# EAGLE design TurntableStrobeModule (EAGLE 7.1.0)
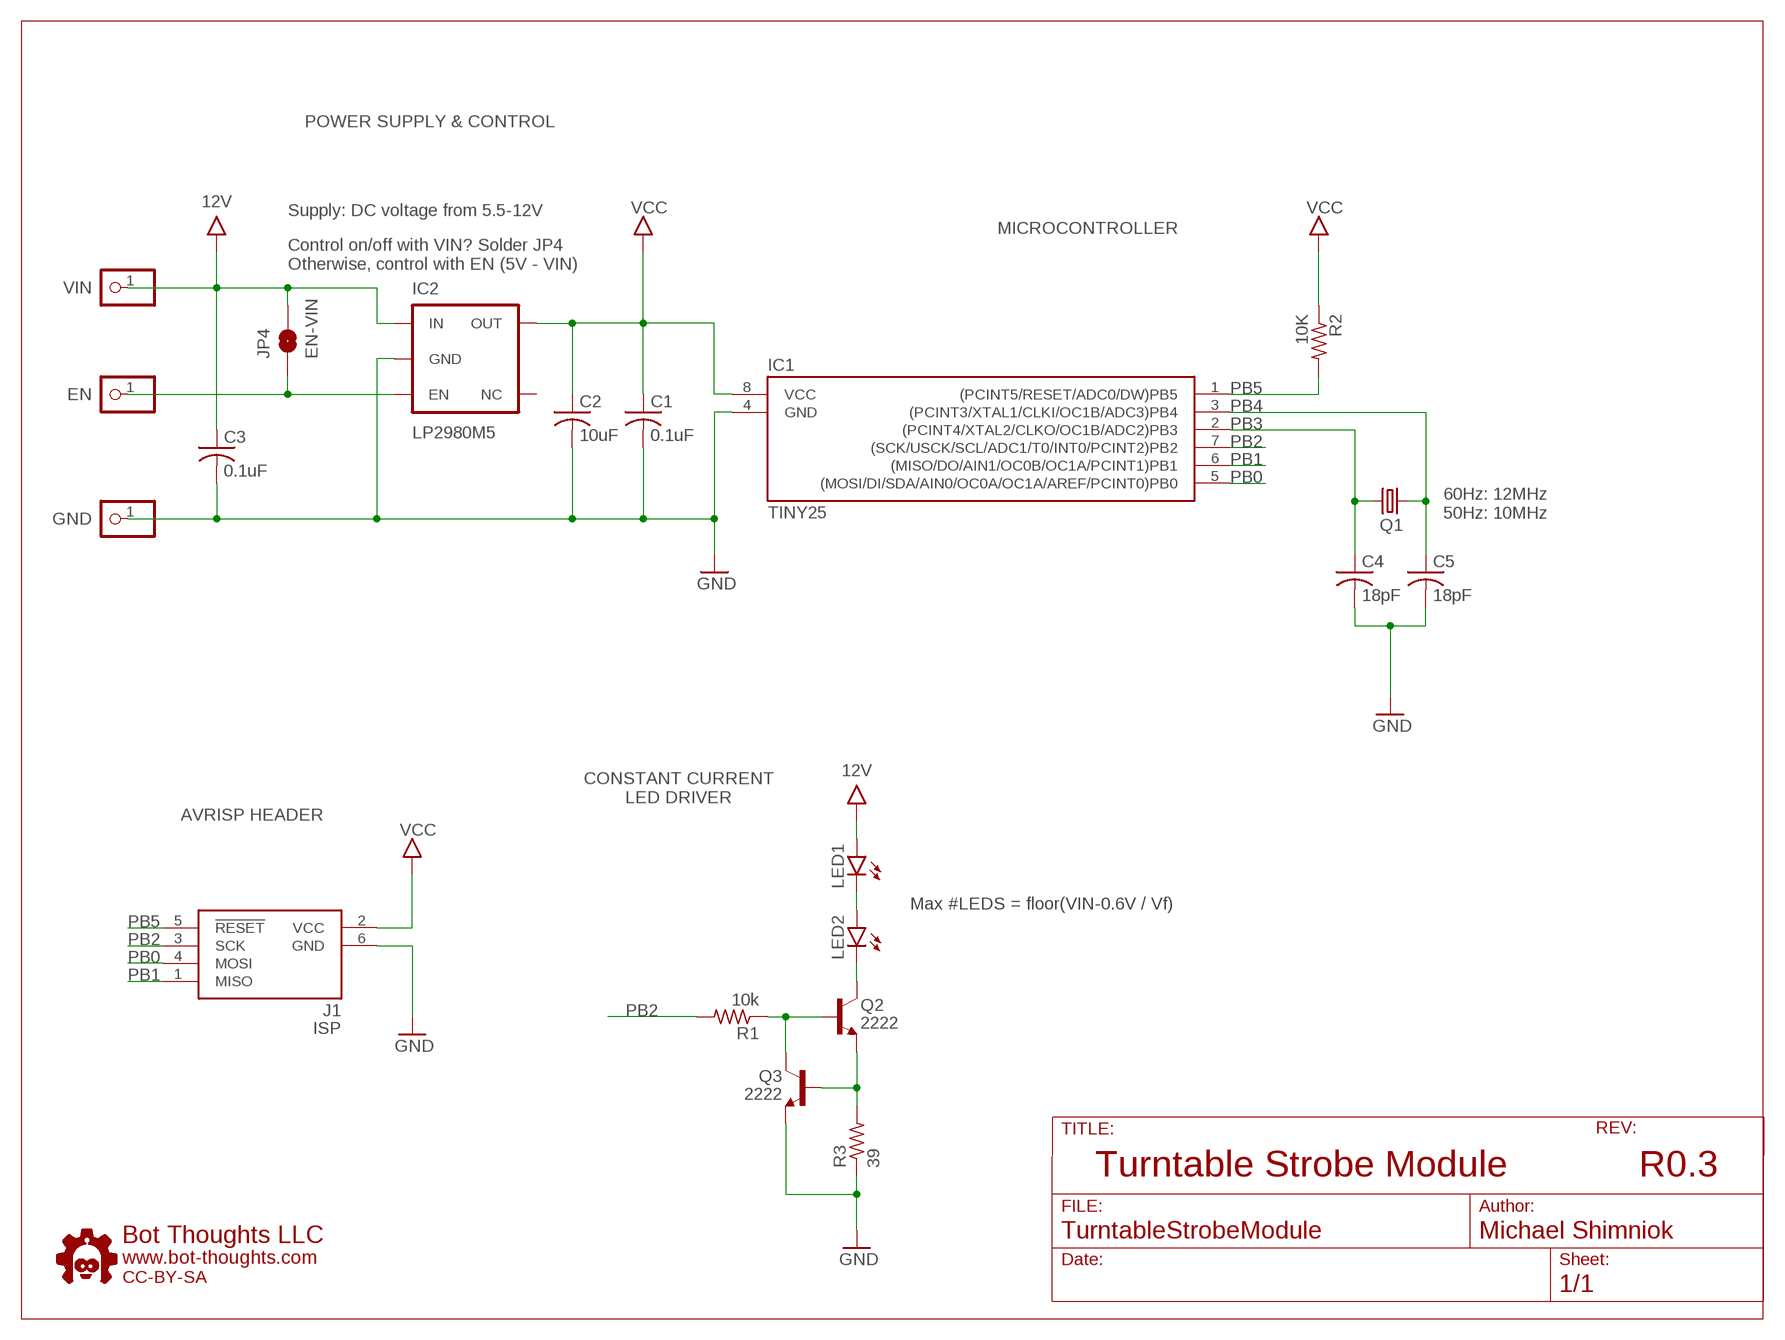
[diagram p0: schematic, sheet 1]

## Parts
C1  0.1uF  C-0603  [0603]
C2  10uF  C-1206  [1206]
C3  0.1uF  C-0603  [0603]
C4  18pF  C-0603  [0603]
C5  18pF  C-0603  [0603]
IC1  TINY25  TINY25/45/85-20SSU  [SOIC8N]
IC2  LP2980M5  [SOT23-5]
J1  ISP  AVRISP6_COMPACT  [CON6P2R]
JP1  EN  PINHD-1X01_2.54-S  [1X01-S]
JP2  VIN  PINHD-1X01_2.54-S  [1X01-S]
JP3  GND  PINHD-1X01_2.54-S  [1X01-S]
JP4  EN-VIN  JUMPER-SMT_2_NO_SILK  [SMT-JUMPER_2_NO_SILK]
LED1  LED5MMRA  [LED5MMRA]
LED2  LED5MMRA  [LED5MMRA]
Q1  CRYSTALNDK5X3  [NDK_2PAD_5X3]
Q2  2222  BJT-NPNSOT23  [SOT-23]
Q3  2222  BJT-NPNSOT23  [SOT-23]
R1  10k  R0603  [0603]
R2  10K  R0603  [0603]
R3  39  R0603  [0603]
U$6  BTLOGO-LOGO-MD  [BTLOGOM]

## Nets
9V: C3.1(+) IC2.1(IN) JP2.1 JP4.2 LED1.A ; supply symbol labelled 12V
GND: C1.2(-) C2.2(-) C3.2(-) C4.2(-) C5.2(-) IC1.4(GND) IC2.2(GND) J1.6(GND) JP3.1 Q3.2(E) R3.1
N$1: Q2.3(B) Q3.1(C) R1.1
N$2: LED1.C LED2.A
N$3: LED2.C Q2.1(C)
N$4: Q2.2(E) Q3.3(B) R3.2
N$5: IC2.3(EN) JP1.1 JP4.1
PB0: IC1.5((MOSI/DI/SDA/AIN0/OC0A/OC1A/AREF/PCINT0)PB0) J1.4(MOSI)
PB1: IC1.6((MISO/DO/AIN1/OC0B/OC1A/PCINT1)PB1) J1.1(MISO)
PB2: IC1.7((SCK/USCK/SCL/ADC1/T0/INT0/PCINT2)PB2) J1.3(SCK) R1.2
PB3: C4.1(+) IC1.2((PCINT4/XTAL2/CLKO/OC1B/ADC2)PB3) Q1.P$2
PB4: C5.1(+) IC1.3((PCINT3/XTAL1/CLKI/OC1B/ADC3)PB4) Q1.P$1
PB5: IC1.1((PCINT5/RESET/ADC0/DW)PB5) J1.5(!RESET) R2.2
VCC: C1.1(+) C2.1(+) IC1.8(VCC) IC2.5(OUT) J1.2(VCC) R2.1
Unconnected: IC2.4(NC)

## Notes on the sheet
- POWER SUPPLY & CONTROL
- Supply: DC voltage from 5.5-12V
- MICROCONTROLLER
- Control on/off with VIN? Solder JP4 
  Otherwise, control with EN (5V - VIN)
- 60Hz: 12MHz
  50Hz: 10MHz
- CONSTANT CURRENT
  LED DRIVER
- AVRISP HEADER
- Max #LEDS = floor(VIN-0.6V / Vf)
- Turntable Strobe Module | R0.3

## Library data of the parts
C1-C5 = bt_rcl:C: Capacitor, non-polarized, American symbol
IC1 = bt_avr:TINY25/45/85: Atmel AVR ATiny25,45,85 8-bit Microcontroller
IC2 = bt_regulator:LP2980: National Semiconductor <http://www.national.com> Micropower Linear Regulator 50mA regulated output, Vin 16V max., ultra-low dropout of 120mV @ 50mA, 1µA standby current
J1 = bt_avr:AVRISP6: 6-pin dual-row connector for Atmel AVRISP programmer interface
JP1-JP3 = bt_electromech:PINHD-1X01: PIN HEADER Generic pin header in a variety of footprints
JP4 = SparkFun-Jumpers:JUMPER-SMT_2_NO: Normally open jumper This jumper has two pads in close proximity to each other. Apply solder to close the connection. Round pads are easier to solder for beginners, but are a lot larger. SparkFun Product that uses the round pads: SparkFun EL Sequencer <https://www.sparkfun.com/products/12781>
LED1 LED2 = bt_opto:LED: LED Various packages
Q1 = bt_crystal:CRYSTAL: CRYSTAL
Q2 Q3 = bt_transistor:BJT-NPN: NPN Transistor Small signal NPN Bipolar Junction Transistor (BJT). Use this device to represent any of a number of such transistors with similar package and pinout: 2N4401, 2N3904, 2N2222, etc.
R1-R3 = bt_rcl:R: Resistor, American symbol
U$6 = bt:BTLOGO: Bot Thoughts Logo

## Board
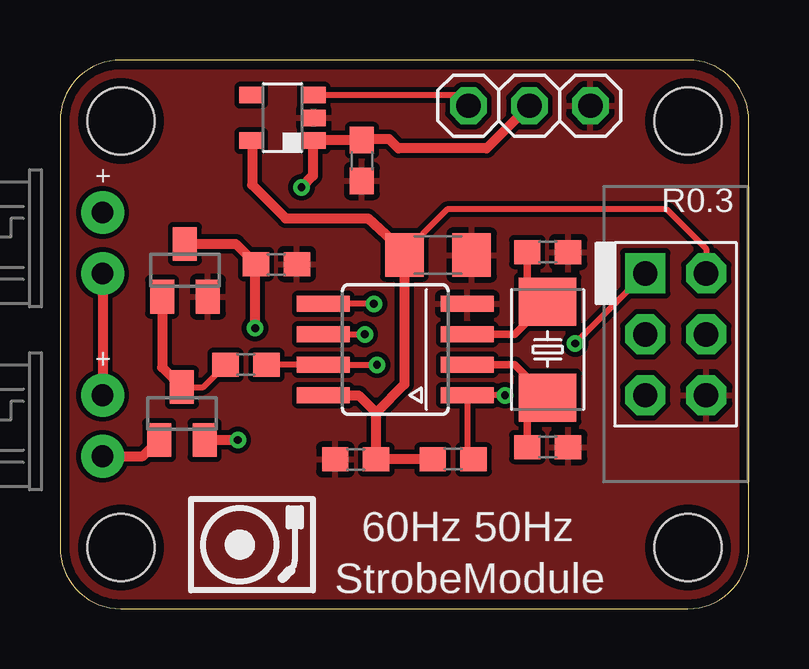
[diagram p1: board, top side]
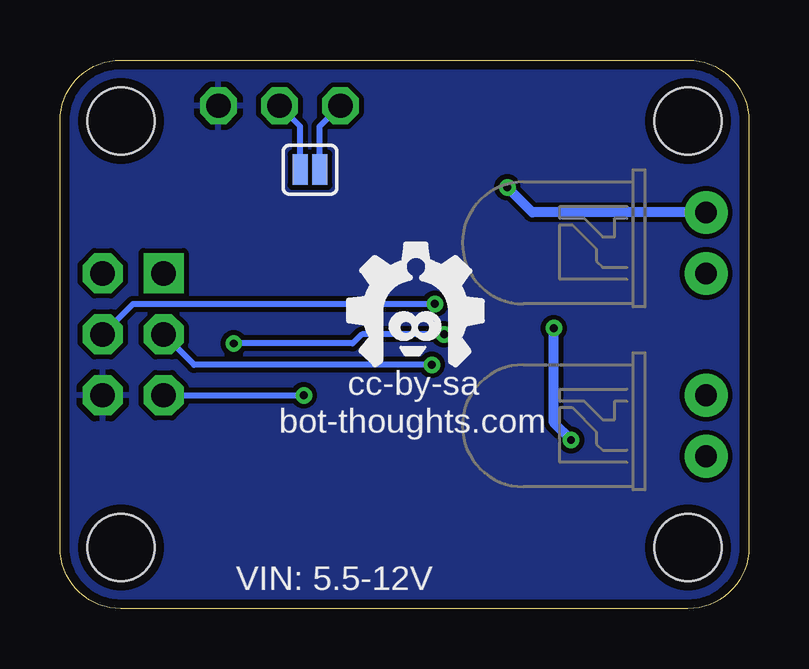
[diagram p2: board, bottom side, seen from below]

Size 28.7 x 22.86 mm. Coordinates in mm from the lower left corner, seen from the top.
Outline: 0,20.32 0,2.54 arc90 2.54,0 26.16,0 arc90 28.7,2.54 28.7,20.32 arc90 26.16,22.86 2.54,22.86 arc90 0,20.32
Copper layers (1*16): Top 0.0356mm / dielectric 1.5011mm / Bottom 0.0356mm
Design rules "default *": minimum track width 6mil, minimum drill 13mil, track to track 6mil, track to pad 6mil, pad to pad 6mil, via to via 6mil, smd to smd 6mil, copper to edge 15mil, drill to drill 6mil, minimum pad ring 7mil, minimum via ring 7mil, stop-mask expansion 4mil, vias tented up to drill 20mil, thermal gap 10mil
Holes 2.8 mm at 2.54,2.54 2.54,20.32 26.16,20.32 26.16,2.54

### Footprints (pad centres in the part's own frame; a part is rotated, then mirrored left to right if it is on the bottom)
0603 = smd 1.1 x 1: 1 -0.85,0; 2 0.85,0
1206 = smd 1.6 x 1.8: 1 -1.4,0; 2 1.4,0
SOIC8N = smd 0.66 x 2.2: 1 -1.905,-3; 2 -0.635,-3; 3 0.635,-3; 4 1.905,-3; 5 1.905,3; 6 0.635,3; 7 -0.635,3; 8 -1.905,3
SOT23-5 = smd 0.69 x 0.99: 1 -0.95,-1.3; 2 0,-1.3; 3 0.95,-1.3; 4 0.95,1.3; 5 -0.95,1.3
CON6P2R = drill 1.016 pad 1.676 square: 1 -2.54,-1.27 | drill 1.016 pad 1.676 octagon: 2 -2.54,1.27; 3 0,-1.27; 4 0,1.27; 5 2.54,-1.27; 6 2.54,1.27
1X01-S = drill 1.016 octagon: 1 0,0
SMT-JUMPER_2_NO_SILK = smd 0.635 x 1.27: 1 -0.406,0; 2 0.406,0
LED5MMRA = drill 0.9 pad 1.778: A 0,1.27; C 0,-1.27
NDK_2PAD_5X3 = smd 2 x 2.4: P$1 -2,0; P$2 2,0
SOT-23 = smd 1 x 1.4: 1 -0.95,-1.1; 2 0.95,-1.1; 3 0,1.1

### Placement (x,y rotation side)
C1  12.32,6.22 180 top
C2  15.75,14.73 0 top
C3  12.57,18.67 270 top
C4  20.32,6.73 0 top
C5  20.32,14.86 0 top
IC1  13.97,10.79 90 top
IC2  9.27,20.45 90 top
J1  25.65,11.43 270 top
JP1  17.02,20.95 270 top
JP2  19.56,20.95 270 top
JP3  22.1,20.95 270 top
JP4  18.29,18.29 180 bottom
LED1  1.78,15.24 0 top
LED2  1.78,7.62 0 top
Q1  20.32,10.79 270 top
Q2  5.08,8.13 0 top
Q3  5.21,14.1 0 top
R1  7.75,10.16 0 top
R2  16.38,6.22 0 top
R3  9.02,14.35 180 top
U$6  13.97,9.91 0 bottom

### Tracks (layer width: path | path; a pad name or v marks a point on that pad's centre or on a via)
9V  (via drill 0.33)
  Top 0.406: JP2.1 17.78,19.18 14.1,19.18 13.72,19.56 12.74,19.56 C3.1 10.55,19.52 IC2.1 10.57,19.46 10.54,19.43 10.54,18.03 v10.06,17.56
  Bottom 0.254: JP4.2 18.69,20.09 JP2.1
  Bottom 0.406: LED1.A 9.02,16.51 v10.06,17.56
GND
  pour Top (isolate 0.203): 0,20.32 0,2.54 arc90 2.54,0 26.16,0 arc90 28.7,2.54 28.7,20.32 arc90 26.16,22.86 2.54,22.86 arc90
  pour Bottom (isolate 0.203): 0,20.32 0,2.54 arc90 2.54,0 26.16,0 arc90 28.7,2.54 28.7,20.32 arc90 26.16,22.86 2.54,22.86 arc90
N$1
  Top 0.254: Q2.3 5.96,9.23 R1.1
  Top 0.406: Q3.1 4.26,10.05 Q2.3
N$2
  Top 0.406: LED1.C LED2.A
N$3
  Top 0.406: LED2.C 3.45,6.35 Q2.1
N$4  (via drill 0.33)
  Top 0.406: Q2.2 v7.41,7.03 | v8.13,11.68 8.13,14.31 R3.2 7.32,15.2 Q3.3
  Bottom 0.406: v7.41,7.03 8.13,7.75 v8.13,11.68
N$5
  Top 0.254: JP1.1 16.58,21.4 IC2.3
  Bottom 0.254: JP4.1 17.88,20.09 JP1.1
PB0  (via drill 0.33)
  Top 0.254: v13.08,12.7 IC1.5
  Bottom 0.254: J1.4 25.65,12.7 v13.08,12.7
PB1  (via drill 0.33)
  Top 0.254: IC1.6 v12.7,11.43 | v21.46,11.05 J1.1
  Bottom 0.254: v12.7,11.43 16.13,11.43 16.51,11.05 v21.46,11.05
PB2  (via drill 0.33)
  Top 0.254: R1.2 IC1.7 v13.21,10.16
  Bottom 0.254: v13.21,10.16 23.11,10.16 J1.3
PB3
  Top 0.305: IC1.2 18.95,10.16 Q1.P$2 20.69,9.16 20.69,9.3 19.47,8.09 C4.1
PB4
  Top 0.305: C5.1 19.47,13.64 Q1.P$1 18.95,11.43 IC1.3
PB5  (via drill 0.33)
  Top 0.254: R2.2 16.97,6.49 IC1.1 v18.54,8.89
  Bottom 0.254: J1.5 v18.54,8.89
VCC
  Top 0.254: J1.2 26.92,14.99 25.27,16.64 16.13,16.64 15.12,15.62 14.35,14.86
  Top 0.406: R2.1 C1.1 13.17,8.17 | IC1.8 12.45,8.89 13.17,8.17 | 13.17,8.17 14.35,9.35 C2.1 14.35,14.86 12.83,16.26 9.4,16.26 8,17.65 8,19.47 IC2.5

### Text on the board
tNames: R0.3 | 60Hz 50Hz | StrobeModule
bNames: cc-by-sa | bot-thoughts.com | VIN: 5.5-12V
tsilk: C2 | 5V | GND | R1 | + | IC1 | ISP | C1 | R2 | StrobeModule | 60.00Hz | R0.2
bsilk: bot-thoughts.com